# EasyEDA Pro project ProPrj_五路触摸_2024-09-28.epro

# Schematic Schematic1
Board Name: Board1; Create Date: 2024-09-14
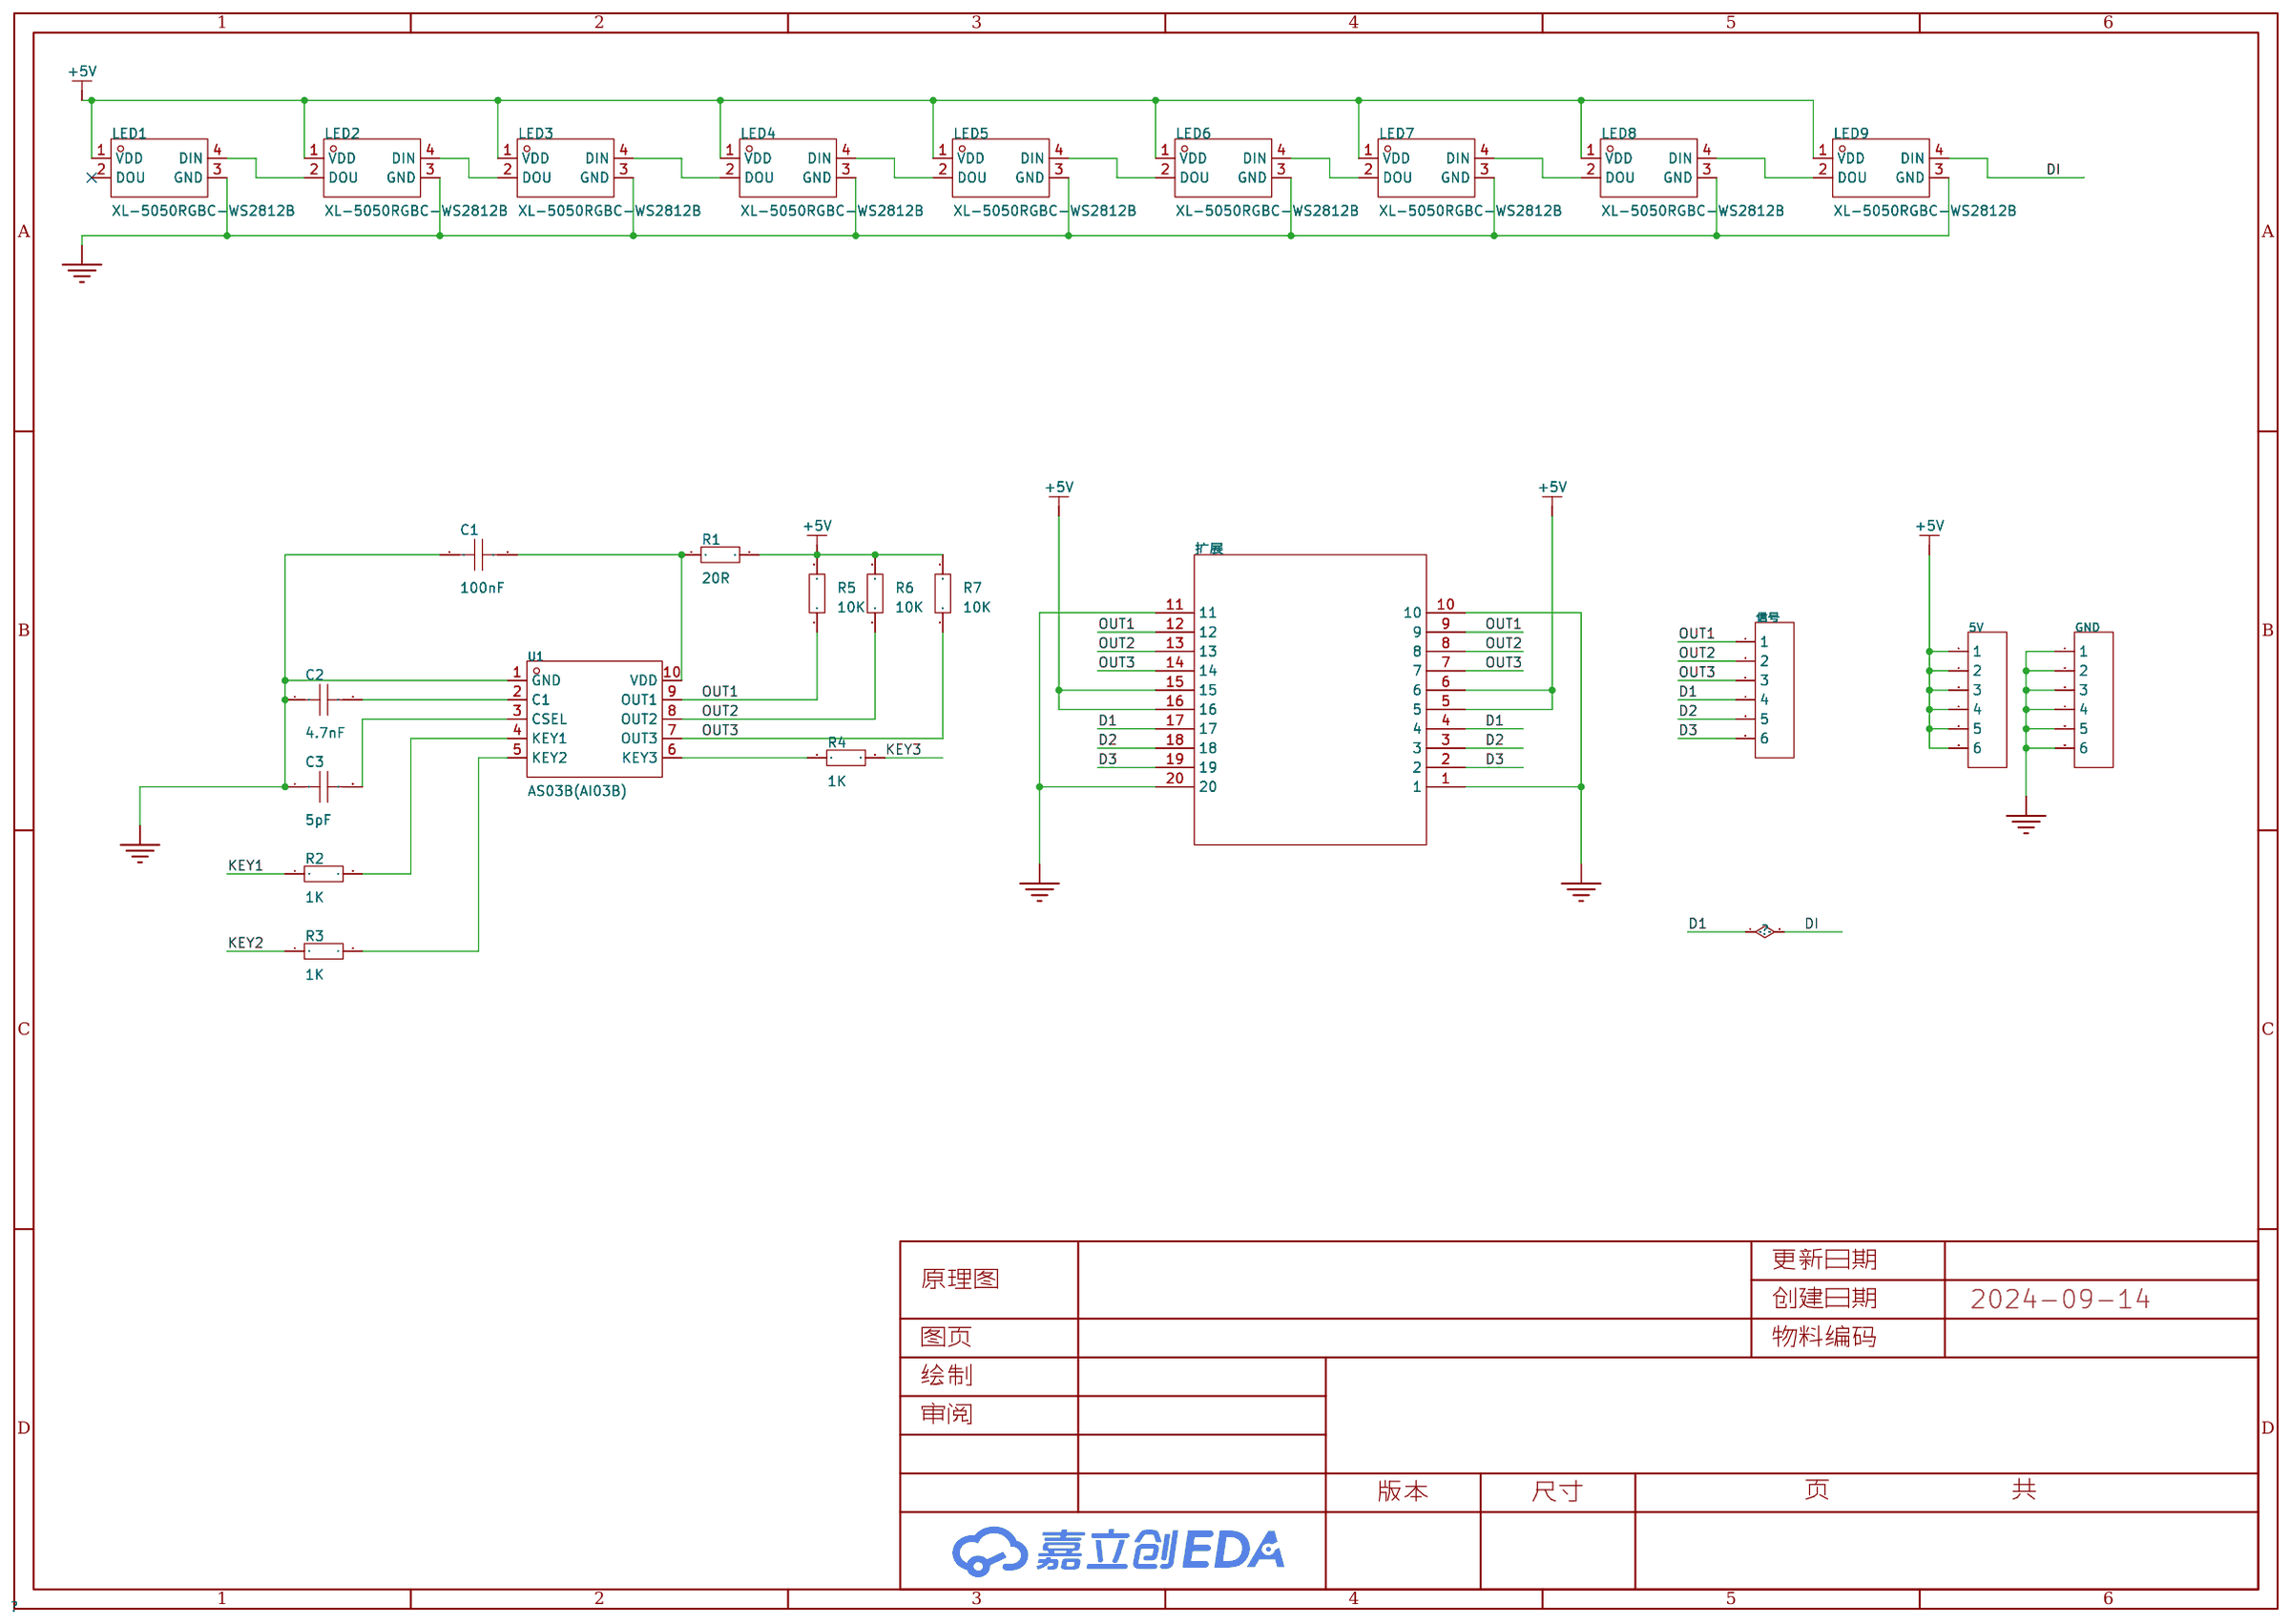
[diagram p0: schematic sheet]

## Parts
5V  -  [HDR-TH_6P-P2.54-V-M-1]
C1  100nF  [C0603]
C2  4.7nF  [C0603]
C3  5pF  [C0603]
GND  -  [HDR-TH_6P-P2.54-V-M-1]
LED1  XL-5050RGBC-WS2812B  [LED-SMD_4P-L5.0-W5.0-BL_XL-5050RGBC]
LED2  XL-5050RGBC-WS2812B  [LED-SMD_4P-L5.0-W5.0-BL_XL-5050RGBC]
LED3  XL-5050RGBC-WS2812B  [LED-SMD_4P-L5.0-W5.0-BL_XL-5050RGBC]
LED4  XL-5050RGBC-WS2812B  [LED-SMD_4P-L5.0-W5.0-BL_XL-5050RGBC]
LED5  XL-5050RGBC-WS2812B  [LED-SMD_4P-L5.0-W5.0-BL_XL-5050RGBC]
LED6  XL-5050RGBC-WS2812B  [LED-SMD_4P-L5.0-W5.0-BL_XL-5050RGBC]
LED7  XL-5050RGBC-WS2812B  [LED-SMD_4P-L5.0-W5.0-BL_XL-5050RGBC]
LED8  XL-5050RGBC-WS2812B  [LED-SMD_4P-L5.0-W5.0-BL_XL-5050RGBC]
LED9  XL-5050RGBC-WS2812B  [LED-SMD_4P-L5.0-W5.0-BL_XL-5050RGBC]
R1  20R  [R0603]
R2  1K  [R0603]
R3  1K  [R0603]
R4  1K  [R0603]
R5  10K  [R0603]
R6  10K  [R0603]
R7  10K  [R0603]
U1  AS03B(AI03B)  [MSOP-10_L3.0-W3.0-P0.50-LS4.9-BL]
信号  -  [HDR-TH_6P-P2.54-V-M-1]
扩展  -  [金手指插座（20p)]

## Library data of the parts
5V GND 信号 = HDR-M_2.54_1x6P: Supplier Part: C37208; Supplier Footprint: 插件
C1-C3 = CAP_0603: Supplier Footprint: 0603
LED1-LED9 = XL-5050RGBC-WS2812B: 5050七彩幻彩透明贴片LED灯珠 5050 幻彩透明四脚 ws2812B 内置驱动IC; Supplier Part: C2843785; Manufacturer: XINGLIGHT(成兴光); Supplier Footprint: SMD5050; JLCPCB Part Class: 扩展库; Datasheet: https://atta.szlcsc.com/upload/public/pdf/source/20240412/E1004CAA80592E31D08BFE019083806F.pdf; Supplier: LCSC
R1-R7 = Res_0603: Supplier Footprint: 0603
U1 = AS03B(AI03B)_C2681994: 通道数:3;; LCSC Part Name: 触摸芯片; Supplier Part: C2681994; Manufacturer: Sam&wing(芯网); Supplier Footprint: MSOP-10; JLCPCB Part Class: 扩展库; Datasheet: https://atta.szlcsc.com/upload/public/pdf/source/20190426/C389622_1D1C26D9E6CF71015856F03BF6C11FB0.pdf; Supplier: LCSC; The Channel Number: 3
扩展 = 金手指插座（20p)

## Nets
+5V: 5V.1 5V.2 5V.3 5V.4 5V.5 5V.6 LED1.1(VDD) LED2.1(VDD) LED3.1(VDD) LED4.1(VDD) LED5.1(VDD) LED6.1(VDD) LED7.1(VDD) LED8.1(VDD) LED9.1(VDD) R1.2 R5.2 R6.2 R7.2 扩展.5 扩展.6 扩展.15 扩展.16
GND: C1.1 C2.1 C3.1 GND.1 GND.2 GND.3 GND.4 GND.5 GND.6 LED1.3(GND) LED2.3(GND) LED3.3(GND) LED4.3(GND) LED5.3(GND) LED6.3(GND) LED7.3(GND) LED8.3(GND) LED9.3(GND) U1.1(GND) 扩展.1 扩展.10 扩展.11 扩展.20
D1: LED9.4(DIN) 信号.4 扩展.4 扩展.17
D2: 信号.5 扩展.3 扩展.18
D3: 信号.6 扩展.2 扩展.19
KEY1: R2.1
KEY2: R3.1
KEY3: R4.2
OUT1: R5.1 U1.9(OUT1) 信号.1 扩展.9 扩展.12
OUT2: R6.1 U1.8(OUT2) 信号.2 扩展.8 扩展.13
OUT3: R7.1 U1.7(OUT3) 信号.3 扩展.7 扩展.14
$1N1128: C1.2 R1.1 U1.10(VDD)
$1N1273: C2.2 U1.2(C1)
$1N1280: C3.2 U1.3(CSEL)
$1N1434: R2.2 U1.4(KEY1)
$1N1440: R3.2 U1.5(KEY2)
$1N1447: R4.1 U1.6(KEY3)
$1N2265: LED1.4(DIN) LED2.2(DOU)
$1N2272: LED2.4(DIN) LED3.2(DOU)
$1N2279: LED3.4(DIN) LED4.2(DOU)
$1N2286: LED4.4(DIN) LED5.2(DOU)
$1N2293: LED5.4(DIN) LED6.2(DOU)
$1N2300: LED6.4(DIN) LED7.2(DOU)
$1N2307: LED7.4(DIN) LED8.2(DOU)
$1N2314: LED8.4(DIN) LED9.2(DOU)

Not connected (* = marked no-connect by the designer): LED1 2(DOU)*

# Board PCB1
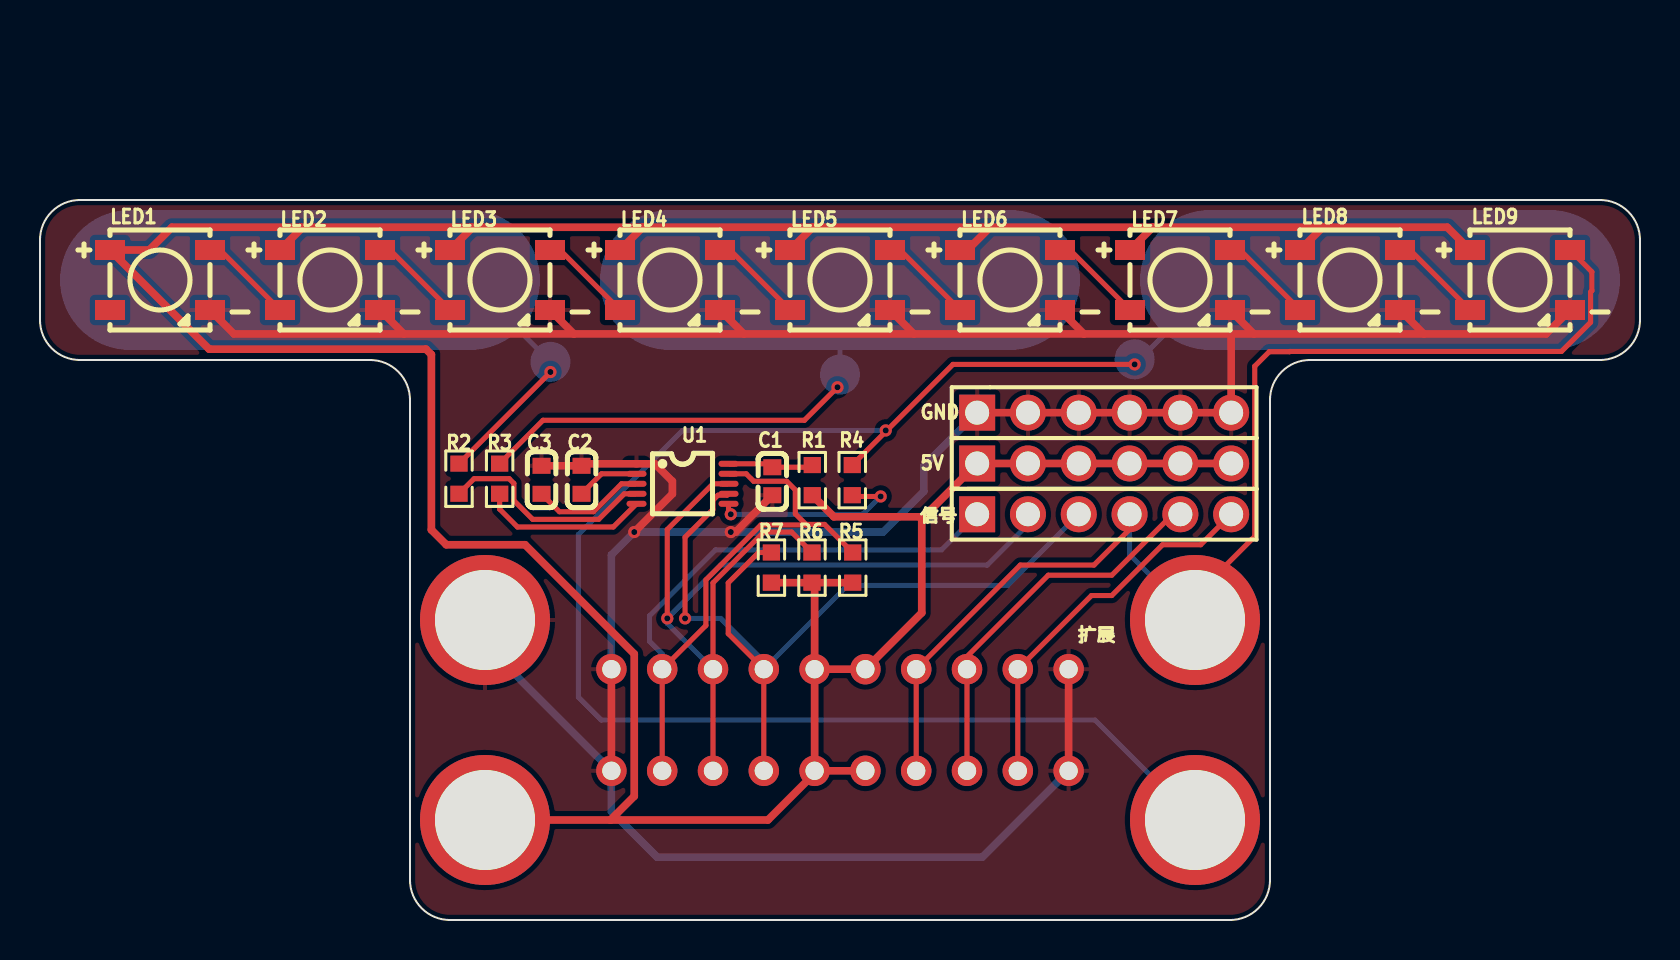
[diagram p1: board, top side]
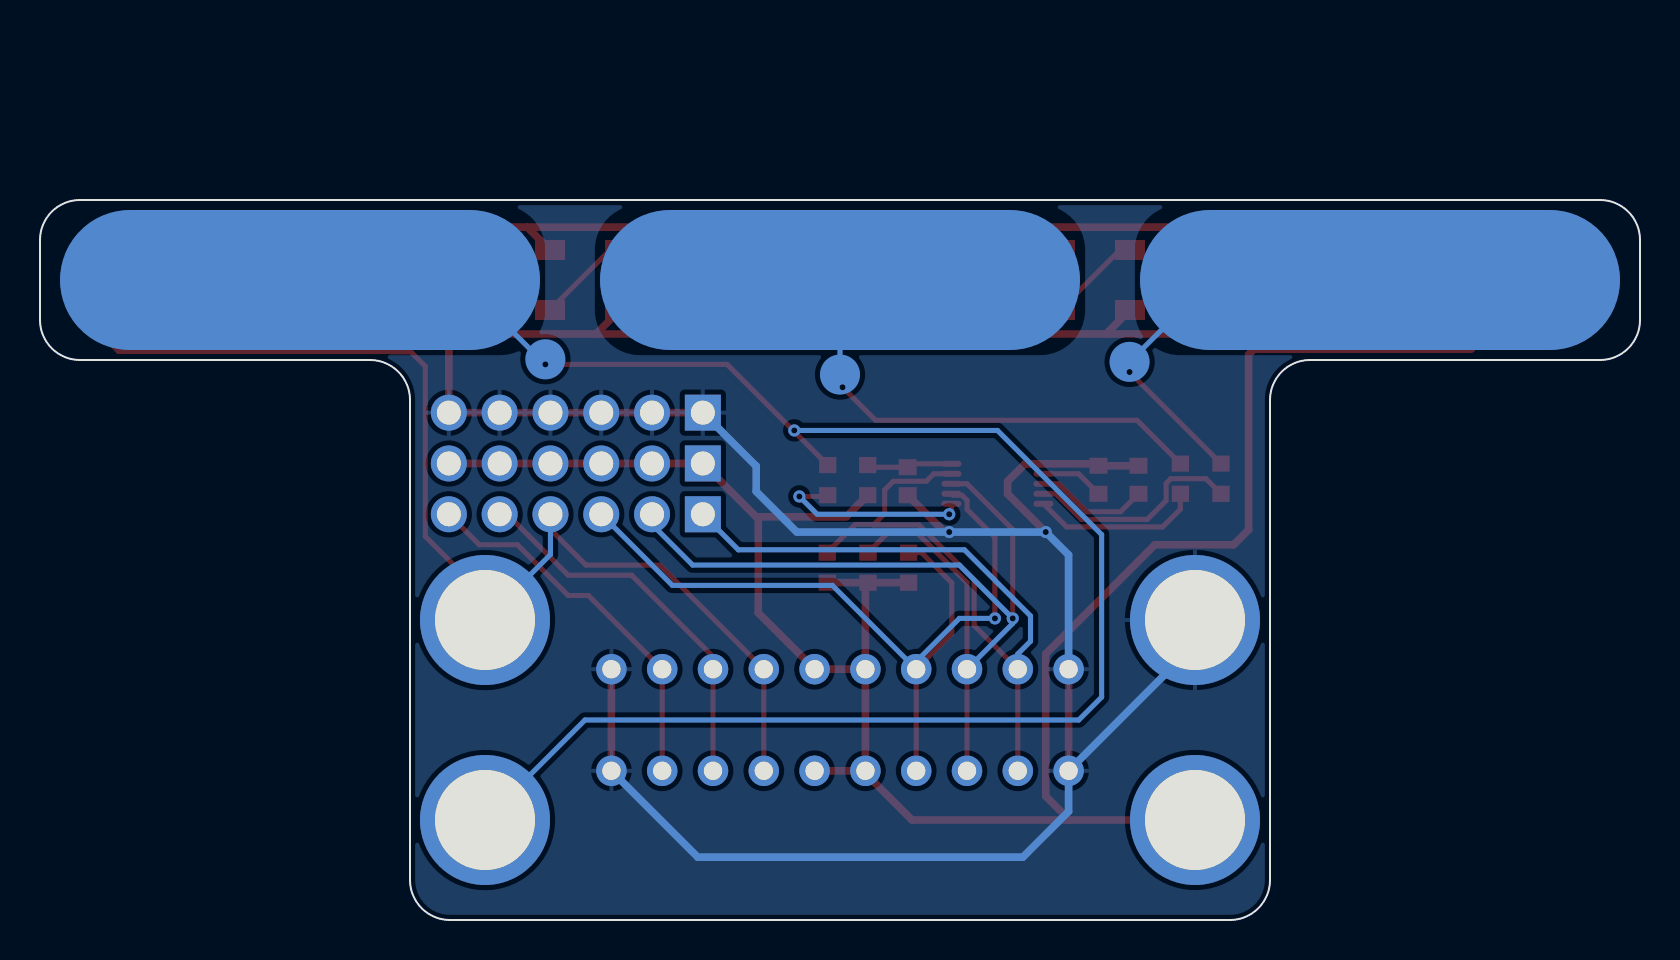
[diagram p2: board, bottom side, seen from below]

Outline 80 x 36 mm; copper layers: Top Layer, Bottom Layer. Coordinates in mm from the lower left corner of the outline.
Outline path: 0,34 arc(0.59,35.41) 2,36 78,36 arc(79.41,35.41) 80,34 80,30 arc(79.41,28.59) 78,28 63.5,28 arc(62.09,27.41) 61.5,26 61.5,2 arc(60.91,0.59) 59.5,0 20.5,0 arc(19.09,0.59) 18.5,2 18.5,26 arc(17.91,27.41) 16.5,28 2,28 arc(0.59,28.59) 0,30 0,34
Stack: Top Layer 0.035mm / Dielectric1 1.51mm FR4 er 4.5 / Bottom Layer 0.035mm

## Design rules (mm)
template: 自定义配置
spacing copperThickness1oz (default): track to track 0.102, other pairs 0.152 to 0.3
spacing copperThickness2oz: track to track 0.203, other pairs 0.152 to 0.3
track width copperThickness1oz (default): min 0.127, default 0.254, max 2.54
track width copperThickness2oz: min 0.203, default 0.254, max 2.54
track width 电源: min 0.127, default 0.381, max 2.54
differential pair differentialPair (default): width min 0.127, default 0.254, max 2.54; gap min 0.152, default 0.152
via viaSize (default): diameter min 0.5, default 0.61, max 10; hole min 0.3, default 0.305, max 6.3
net GND uses 电源
net +5V uses 电源

## Placement (name value [footprint] x y rotation side)
5V  -  [HDR-TH_6P-P2.54-V-M-1]  53.21 22.83 0 top
C1  100nF  [C0603]  36.62 21.94 90 top
C2  4.7nF  [C0603]  27.08 22.01 270 top
C3  5pF  [C0603]  25.08 22.01 270 top
GND  -  [HDR-TH_6P-P2.54-V-M-1]  53.21 25.37 0 top
LED1  XL-5050RGBC-WS2812B  [LED-SMD_4P-L5.0-W5.0-BL_XL-5050RGBC]  6 32 270 top
LED2  XL-5050RGBC-WS2812B  [LED-SMD_4P-L5.0-W5.0-BL_XL-5050RGBC]  14.5 32 270 top
LED3  XL-5050RGBC-WS2812B  [LED-SMD_4P-L5.0-W5.0-BL_XL-5050RGBC]  23 32 270 top
LED4  XL-5050RGBC-WS2812B  [LED-SMD_4P-L5.0-W5.0-BL_XL-5050RGBC]  31.5 32 270 top
LED5  XL-5050RGBC-WS2812B  [LED-SMD_4P-L5.0-W5.0-BL_XL-5050RGBC]  40 32 270 top
LED6  XL-5050RGBC-WS2812B  [LED-SMD_4P-L5.0-W5.0-BL_XL-5050RGBC]  48.5 32 270 top
LED7  XL-5050RGBC-WS2812B  [LED-SMD_4P-L5.0-W5.0-BL_XL-5050RGBC]  57 32 270 top
LED8  XL-5050RGBC-WS2812B  [LED-SMD_4P-L5.0-W5.0-BL_XL-5050RGBC]  65.5 32 270 top
LED9  XL-5050RGBC-WS2812B  [LED-SMD_4P-L5.0-W5.0-BL_XL-5050RGBC]  74 32 270 top
NOREF  -  [Pad_e60]  57.75 15 0 top
NOREF#2  -  [Pad_e58]  22.25 15 0 top
NOREF#3  -  [Pad_e66]  67 32 0 top
NOREF#4  -  [Pad_e61]  57.75 5 0 top
NOREF#5  -  [Pad_e71]  54.73 28.03 0 top
NOREF#6  -  [Pad_e69]  13 32 0 top
NOREF#7  -  [Pad_e73]  25.52 27.91 0 top
NOREF#8  -  [Pad_e68]  40 32 0 top
NOREF#9  -  [Pad_e59]  22.25 5 0 top
NOREF#10  -  [Pad_e72]  40 27.27 0 top
R1  20R  [R0603]  38.61 21.99 270 top
R2  1K  [R0603]  20.95 22.06 270 top
R3  1K  [R0603]  22.98 22.06 270 top
R4  1K  [R0603]  40.61 21.99 90 top
R5  10K  [R0603]  40.63 17.62 270 top
R6  10K  [R0603]  38.6 17.62 270 top
R7  10K  [R0603]  36.57 17.62 270 top
U1  AS03B(AI03B)  [MSOP-10_L3.0-W3.0-P0.50-LS4.9-BL]  32.13 21.81 270 top
信号  -  [HDR-TH_6P-P2.54-V-M-1]  53.21 20.29 0 top
扩展  -  [金手指插座（20p)]  40 10 180 top

## Footprints (pads in the part's own frame, mm; a bottom-side part is the same pattern mirrored in y, then rotated)
C0603
  rect 0.8x0.9 smd: 1(-0.7,0) 2(0.7,0)
HDR-TH_6P-P2.54-V-M-1
  rect 1.8x1.8 hole 1.2: 1(-6.35,0)
  round 1.8 hole 1.2: 2(-3.81,0) 3(-1.27,0) 4(1.27,0) 5(3.81,0) 6(6.35,0)
LED-SMD_4P-L5.0-W5.0-BL_XL-5050RGBC
  rect 1x1.5 smd: 1(-1.5,-2.5) 2(1.5,-2.5) 3(1.5,2.5) 4(-1.5,2.5)
MSOP-10_L3.0-W3.0-P0.50-LS4.9-BL
  oval 0.3x1 smd: 1(-1,-2.3) 2(-0.5,-2.3) 3(0,-2.3) 4(0.5,-2.3) 5(1,-2.3) 6(1,2.3) 7(0.5,2.3) 8(0,2.3) 9(-0.5,2.3) 10(-1,2.3)
Pad_e58
  round 6.5 hole 5: GND(0,0)
Pad_e59
  round 6.5 hole 5: 5V(0,0)
Pad_e60
  round 6.5 hole 5: D(0,0)
Pad_e61
  round 6.5 hole 5: K3(0,0)
Pad_e66
  rrect 24x7 smd far side: 3(0,0)
Pad_e68
  rrect 24x7 smd far side: 2(0,0)
Pad_e69
  rrect 24x7 smd far side: 1(0,0)
Pad_e71
  round 2 smd far side: 33(0,0)
Pad_e72
  round 2 smd far side: 22(0,0)
Pad_e73
  round 2 smd far side: 11(0,0)
R0603
  rect 0.806x0.864 smd: 1(-0.753,0) 2(0.753,0)
金手指插座（20p)
  round 1.524 hole 0.914: 1(-11.43,2.54) 2(-8.89,2.54) 3(-6.35,2.54) 4(-3.81,2.54) 5(-1.27,2.54) 6(1.27,2.54) 7(3.81,2.54) 8(6.35,2.54) 9(8.89,2.54) 10(11.43,2.54) 11(11.43,-2.54) 12(8.89,-2.54) 13(6.35,-2.54) 14(3.81,-2.54) 15(1.27,-2.54) 16(-1.27,-2.54) 17(-3.81,-2.54) 18(-6.35,-2.54) 19(-8.89,-2.54) 20(-11.43,-2.54)

## Nets
+5V: 5V.1 5V.2 5V.3 5V.4 5V.5 5V.6 LED1.1 LED2.1 LED3.1 LED4.1 LED5.1 LED6.1 LED7.1 LED8.1 LED9.1 NOREF#9.5V R1.2 R5.2 R6.2 R7.2 扩展.5 扩展.6 扩展.15 扩展.16
GND: C1.1 C2.1 C3.1 GND.1 GND.2 GND.3 GND.4 GND.5 GND.6 LED1.3 LED2.3 LED3.3 LED4.3 LED5.3 LED6.3 LED7.3 LED8.3 LED9.3 NOREF#2.GND U1.1 扩展.1 扩展.10 扩展.11 扩展.20
D1: LED9.4 NOREF.D 信号.4 扩展.4 扩展.17
D2: 信号.5 扩展.3 扩展.18
D3: 信号.6 扩展.2 扩展.19
KEY1: NOREF#6.1 NOREF#7.11 R2.1
KEY2: NOREF#8.2 NOREF#10.22 R3.1
KEY3: NOREF#3.3 NOREF#4.K3 NOREF#5.33 R4.2
OUT1: R5.1 U1.9 信号.1 扩展.9 扩展.12
OUT2: R6.1 U1.8 信号.2 扩展.8 扩展.13
OUT3: R7.1 U1.7 信号.3 扩展.7 扩展.14
$1N1128: C1.2 R1.1 U1.10
$1N1273: C2.2 U1.2
$1N1280: C3.2 U1.3
$1N1434: R2.2 U1.4
$1N1440: R3.2 U1.5
$1N1447: R4.1 U1.6
$1N2265: LED1.4 LED2.2
$1N2272: LED2.4 LED3.2
$1N2279: LED3.4 LED4.2
$1N2286: LED4.4 LED5.2
$1N2293: LED5.4 LED6.2
$1N2300: LED6.4 LED7.2
$1N2307: LED7.4 LED8.2
$1N2314: LED8.4 LED9.2

Pads without a net: LED1 2

## Via types
v1: diameter 0.61, hole 0.305, Top Layer to Bottom Layer, 10 vias

## Routing (per net, layer and track width the routed paths; a pad name or vN(x,y) marks a point on that pad's centre or on a via; arc(x,y) is an arc through that point)
+5V: length 196.5
  Top Layer w0.381: R1.2 39.69,20.16 44.09,20.16 ; LED6.1 46.37,33.5 47.51,34.64 ; LED4.1 30.14,34.64 ; 30.14,34.64 21.54,34.64 ; 30.14,34.64 38.64,34.64 ; 47.51,34.64 38.64,34.64 ; 47.51,34.64 55.64,34.64 ; 38.64,34.64 LED5.1 ; 44.09,20.16 44.09,15.36 扩展.16 扩展.15 ; 44.09,20.16 44.19,20.16 5V.1 5V.2 5V.3 5V.4 5V.5 5V.6 ; 13.03,34.64 6.6,34.64 5.46,33.5 LED1.1 8.46,28.54 19.3,28.54 19.57,28.27 19.57,19.51 20.31,18.76 24.25,18.76 29.71,13.3 29.71,6.19 28.52,5 ; 13.03,34.64 21.54,34.64 ; 13.03,34.64 13.03,34.53 LED2.1 ; 38.86,7.46 扩展.5 ; 38.86,7.46 36.4,5 28.52,5 ; 38.86,7.46 扩展.6 扩展.15 ; 21.54,34.64 21.54,34.54 LED3.1 ; 扩展.15 38.73,16.74 38.61,16.86 ; 64.14,34.64 70.36,34.64 LED9.1 ; 64.14,34.64 55.64,34.64 ; 64.14,34.64 LED8.1 ; R5.2 R6.2 R7.2 ; 28.52,5 NOREF#9.5V ; 55.64,34.64 LED7.1
GND: length 186.2
  Top Layer w0.381: v1(34.54,19.4) 34.78,19.4 C1.1 ; 扩展.10 扩展.11 ; LED7.3 60.7,29.3 ; 60.7,29.3 59.52,29.3 ; 60.7,29.3 69.2,29.3 ; LED3.3 26.7,29.3 ; 26.7,29.3 35.2,29.3 ; 26.7,29.3 18.2,29.3 ; 18.2,29.3 9.7,29.3 LED1.3 ; 18.2,29.3 LED2.3 ; GND.1 GND.2 GND.3 GND.4 GND.5 GND.6 59.56,29.27 59.52,29.3 ; 扩展.1 扩展.20 ; 35.2,29.3 LED4.3 ; 35.2,29.3 43.7,29.3 ; 59.52,29.3 52.2,29.3 ; 52.2,29.3 43.7,29.3 ; 52.2,29.3 LED6.3 ; 69.2,29.3 75.3,29.3 LED9.3 ; 69.2,29.3 LED8.3 ; v1(29.71,19.4) 31.62,21.3 31.62,21.94 30.75,22.81 U1.1 27.18,22.81 C2.1 C3.1 ; 43.7,29.3 LED5.3
  Bottom Layer w0.381: 扩展.11 28.57,18.25 v1(29.71,19.4) v1(34.54,19.4) 42.16,19.4 44.19,21.43 44.19,22.7 GND.1 ; 扩展.1 47.11,3.14 30.86,3.14 28.57,5.43 扩展.10 22.25,13.78 NOREF#2.GND
D1: length 61.8
  Top Layer w0.254: LED9.4 77.59,32.41 77.59,31.46 77.53,31.4 77.53,29.88 76.07,28.43 62.49,28.43 62.48,28.42 61.46,28.42 60.74,27.69 60.74,19.18 57.75,16.19 NOREF.D ; 信号.4 54.48,19.53 52.7,17.75 49.02,17.75 扩展.17 扩展.4
  Bottom Layer w0.254: NOREF.D 54.48,18.27 信号.4
D2: length 19.3
  Top Layer w0.254: 信号.5 56.64,20.29 53.59,17.24 50.41,17.24 46.35,13.17 扩展.18 扩展.3
D3: length 19
  Top Layer w0.254: 信号.6 58.03,18.76 56.13,18.76 53.59,16.22 52.57,16.22 扩展.19 扩展.2
KEY1: length 21.2
  Top Layer w0.254: R2.1 25.52,27.39 v1(25.52,27.4)
  Bottom Layer w0.254: v1(25.52,27.4) NOREF#7.11 21.43,32 NOREF#6.1
KEY2: length 23.2
  Top Layer w0.254: R3.1 25.15,24.99 38.22,24.99 v1(39.87,26.64)
  Bottom Layer w0.254: NOREF#10.22 NOREF#8.2
KEY3: length 89.2
  Top Layer w0.254: R4.2 45.65,27.78 v1(54.73,27.78)
  Bottom Layer w0.254: v1(54.73,27.78) 58.95,32 NOREF#3.3 ; NOREF#4.K3 52.75,10 28.06,10 26.92,11.14 26.92,19.27 32.13,24.48 v1(42.29,24.48)
OUT1: length 46.6
  Top Layer w0.254: 扩展.9 扩展.12 33.29,14.72 33.29,17.01 36.04,19.75 38.32,19.75 ; 38.32,19.75 37.77,20.31 37.77,21.5 37.33,21.94 35.68,21.94 35.31,22.31 U1.9 ; 38.32,19.75 38.35,19.78 39.23,19.78 R5.1
  Bottom Layer w0.254: 信号.1 45.08,18.51 33.78,18.51 30.47,15.21 30.47,13.94 31.11,13.3 扩展.12
OUT2: length 48.3
  Top Layer w0.254: v1(31.36,15.08) 31.36,19.53 33.65,21.81 U1.8 ; 扩展.8 扩展.13 33.65,16.86 36.19,19.4 37.57,19.4 R6.1
  Bottom Layer w0.254: 扩展.13 31.36,14.83 v1(31.36,15.08) 34.03,17.75 47.37,17.75 49.4,19.78 信号.2
OUT3: length 44.5
  Top Layer w0.254: v1(32.25,15.08) 32.25,19.14 33.65,20.53 33.65,20.99 33.9,21.24 34.35,21.24 U1.7 ; R7.1 35.93,18.37 34.41,16.86 34.41,14.32 扩展.14 扩展.7
  Bottom Layer w0.254: v1(32.25,15.08) 34.03,15.08 36.19,12.92 扩展.14 40.38,16.73 48.38,16.73 信号.3
$1N1128: length 4.3
  Top Layer w0.254: U1.10 36.44,22.81 C1.2 38.5,22.64 R1.1
$1N1273: length 3.2
  Top Layer w0.254: U1.2 28.08,22.31 27.08,21.31
$1N1280: length 5.7
  Top Layer w0.254: 25.08,21.31 25.97,20.41 27.68,20.41 29.08,21.81 U1.3
$1N1434: length 11.1
  Top Layer w0.254: U1.4 29.21,21.31 27.94,20.03 24.63,20.03 23.69,20.97 23.69,21.83 23.46,22.06 21.7,22.06 R2.2
$1N1440: length 8.5
  Top Layer w0.254: R3.2 22.98,20.54 23.87,19.65 28.67,19.65 U1.5
$1N1447: length 9.9
  Top Layer w0.254: U1.6 34.43,20.4 v1(34.54,20.29) ; v1(42.03,21.18) 40.68,21.18 R4.1
  Bottom Layer w0.254: v1(34.54,20.29) 41.14,20.29 v1(42.03,21.18)
$1N2265: length 4.7
  Top Layer w0.254: LED2.2 9,33.5 LED1.4
$1N2272: length 4.7
  Top Layer w0.254: LED2.4 17.5,33.5 LED3.2
$1N2279: length 4.7
  Top Layer w0.254: LED4.2 26,33.5 LED3.4
$1N2286: length 4.7
  Top Layer w0.254: LED5.2 34.5,33.5 LED4.4
$1N2293: length 4.7
  Top Layer w0.254: LED6.2 43,33.5 LED5.4
$1N2300: length 4.7
  Top Layer w0.254: LED6.4 51.5,33.5 LED7.2
$1N2307: length 4.7
  Top Layer w0.254: LED8.2 60,33.5 LED7.4
$1N2314: length 4.7
  Top Layer w0.254: LED9.2 68.5,33.5 LED8.4

## Copper pours and planes (outline as drawn; the poured copper is in the pictures)
GND on Top Layer: -2.8,41.75 83.31,41.75 83.31,-5.37 -2.8,-5.37
GND on Bottom Layer: -6.1,43.15 85.72,43.15 85.72,-7.02 -6.1,-7.02
